# EAGLE design Robot Car (EAGLE 9.6.2)
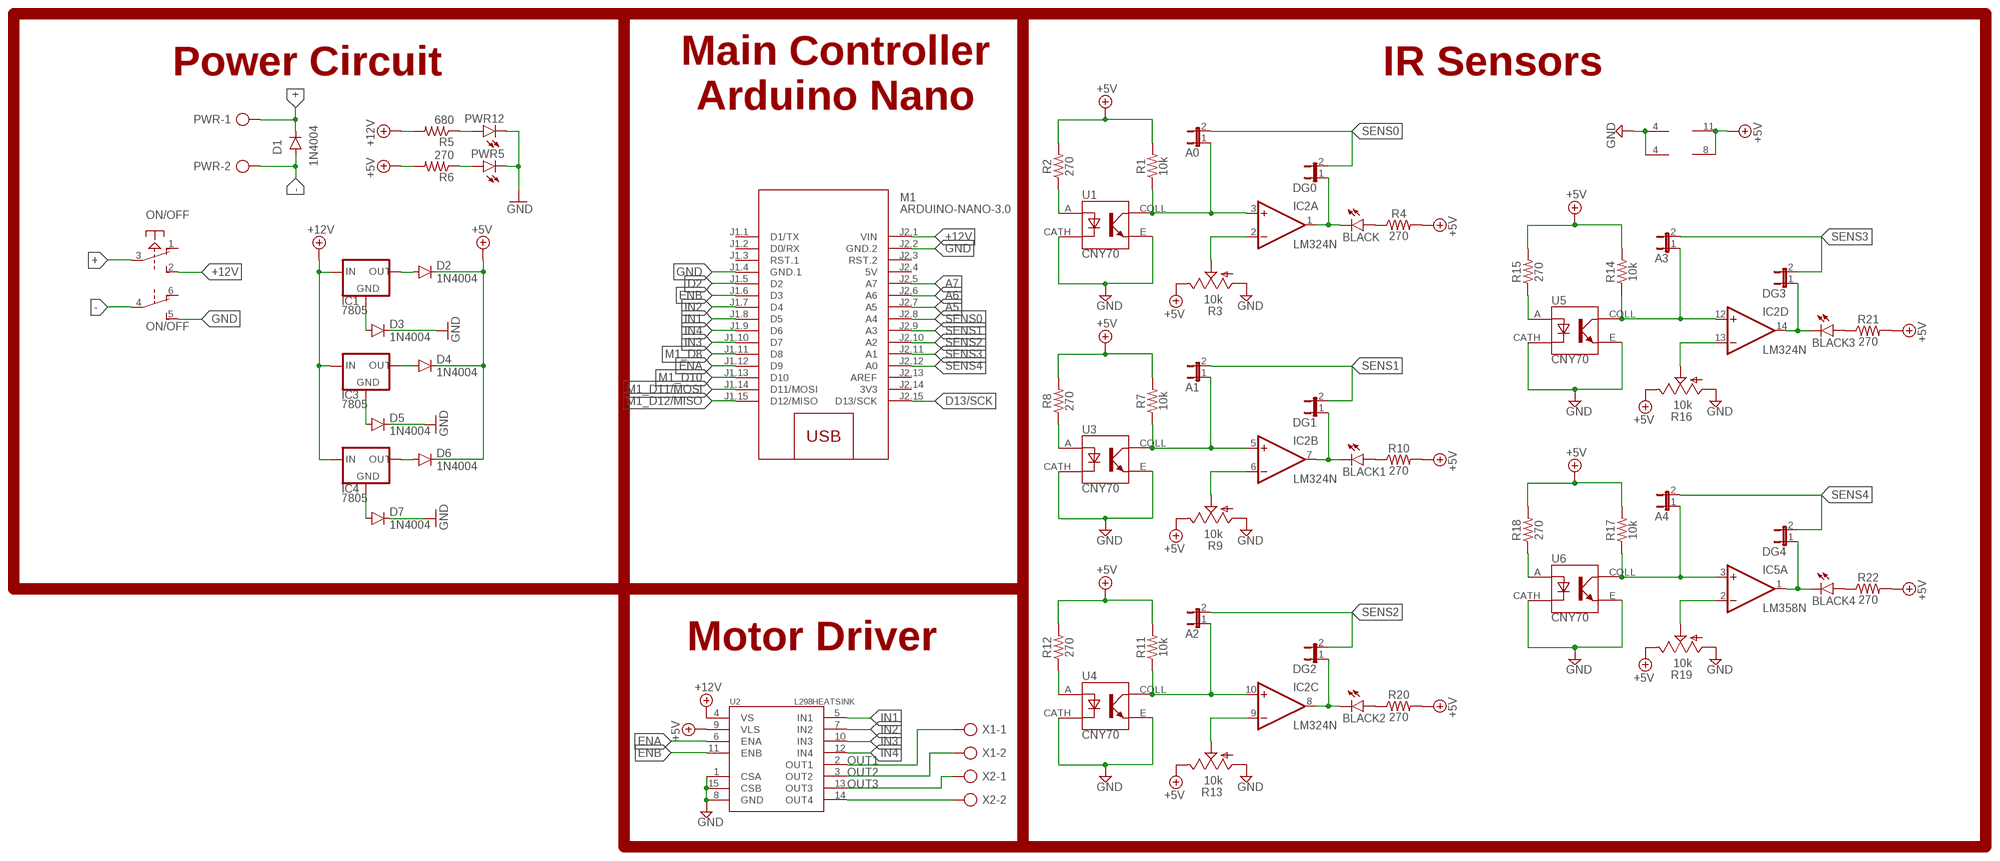
[diagram p0: schematic, sheet 1]

## Parts
A0  JP1E  [JP1]
A1  JP1E  [JP1]
A2  JP1E  [JP1]
A3  JP1E  [JP1]
A4  JP1E  [JP1]
BLACK  LED3MM  [LED3MM]
BLACK1  LED3MM  [LED3MM]
BLACK2  LED3MM  [LED3MM]
BLACK3  LED3MM  [LED3MM]
BLACK4  LED3MM  [LED3MM]
D1  1N4004  [DO41-10]
D2  1N4004  [DO41-10]
D3  1N4004  [DO41-10]
D4  1N4004  [DO41-10]
D5  1N4004  [DO41-10]
D6  1N4004  [DO41-10]
D7  1N4004  [DO41-10]
DG0  JP1E  [JP1]
DG1  JP1E  [JP1]
DG2  JP1E  [JP1]
DG3  JP1E  [JP1]
DG4  JP1E  [JP1]
IC1  7805  78XXS  [78XXS]
IC2  LM324N  [DIL14]
IC3  7805  78XXS  [78XXS]
IC4  7805  78XXS  [78XXS]
IC5  LM358N  [DIL08]
M1  ARDUINO-NANO-3.0  [ARDUINO-NANO-3.0]
ON/OFF  PVA2R  [PVA2R]
PWR  AK500/2-H  [AK500/2-H]
PWR5  LED3MM  [LED3MM]
PWR12  LED3MM  [LED3MM]
R1  10k  RESISTORAXIAL-0.3  [AXIAL-0.3]
R2  270  RESISTORAXIAL-0.3  [AXIAL-0.3]
R3  10k  TRIM_US-CA6V  [CA6V]
R4  270  RESISTORAXIAL-0.3  [AXIAL-0.3]
R5  680  RESISTORAXIAL-0.3  [AXIAL-0.3]
R6  270  RESISTORAXIAL-0.3  [AXIAL-0.3]
R7  10k  RESISTORAXIAL-0.3  [AXIAL-0.3]
R8  270  RESISTORAXIAL-0.3  [AXIAL-0.3]
R9  10k  TRIM_US-CA6V  [CA6V]
R10  270  RESISTORAXIAL-0.3  [AXIAL-0.3]
R11  10k  RESISTORAXIAL-0.3  [AXIAL-0.3]
R12  270  RESISTORAXIAL-0.3  [AXIAL-0.3]
R13  10k  TRIM_US-CA6V  [CA6V]
R14  10k  RESISTORAXIAL-0.3  [AXIAL-0.3]
R15  270  RESISTORAXIAL-0.3  [AXIAL-0.3]
R16  10k  TRIM_US-CA6V  [CA6V]
R17  10k  RESISTORAXIAL-0.3  [AXIAL-0.3]
R18  270  RESISTORAXIAL-0.3  [AXIAL-0.3]
R19  10k  TRIM_US-CA6V  [CA6V]
R20  270  RESISTORAXIAL-0.3  [AXIAL-0.3]
R21  270  RESISTORAXIAL-0.3  [AXIAL-0.3]
R22  270  RESISTORAXIAL-0.3  [AXIAL-0.3]
U1  CNY70  [DIPS254W50P254L710H600Q4]
U2  L298HEATSINK  [MULTIWATT15_6400BGHEATSINK]
U3  CNY70  [DIPS254W50P254L710H600Q4]
U4  CNY70  [DIPS254W50P254L710H600Q4]
U5  CNY70  [DIPS254W50P254L710H600Q4]
U6  CNY70  [DIPS254W50P254L710H600Q4]
X1  AK500/2-H  [AK500/2-H]
X2  AK500/2-H  [AK500/2-H]

## Nets
+: D1.C ON/OFF.3(1:P) PWR.1
+5V: D2.C D4.C D6.C IC2.11(P:V-) IC5.8(P:V+) R1.P$2 R2.P$2 R3.E R4.P$2 R6.P$2 R7.P$2 R8.P$2 R9.E R10.P$2 R11.P$2 R12.P$2 R13.E R14.P$2 R15.P$2 R16.E R17.P$2 R18.P$2 R19.E R20.P$2 R21.P$2 R22.P$2 U2.9(VLS)
+12V: IC1.IN IC3.IN IC4.IN M1.J2.1(VIN) ON/OFF.2(1:S) R5.P$2 U2.4(VS)
-: D1.A ON/OFF.4(2:P) PWR.2
A5: M1.J2.7(A5)
A6: M1.J2.6(A6)
A7: M1.J2.5(A7)
D2: M1.J1.5(D2)
D13/SCK: M1.J2.15(D13/SCK)
ENA: M1.J1.12(D9) U2.6(ENA)
ENB: M1.J1.6(D3) U2.11(ENB)
GND: D3.C D5.C D7.C IC2.4(P:V+) IC5.4(P:V-) M1.J1.4(GND.1) M1.J2.2(GND.2) ON/OFF.5(2:S) PWR5.K(C) PWR12.K(C) R3.A R9.A R13.A R16.A R19.A U1.CATH U1.E U2.1(CSA) U2.8(GND) U2.15(CSB) U3.CATH U3.E U4.CATH U4.E U5.CATH U5.E U6.CATH U6.E
IN1: M1.J1.8(D5) U2.5(IN1)
IN2: M1.J1.7(D4) U2.7(IN2)
IN3: M1.J1.10(D7) U2.10(IN3)
IN4: M1.J1.9(D6) U2.12(IN4)
M1_D8: M1.J1.11(D8)
M1_D10: M1.J1.13(D10)
M1_D11/MOSI: M1.J1.14(D11/MOSI)
M1_D12/MISO: M1.J1.15(D12/MISO)
N$1: R2.P$1 U1.A
N$2: PWR12.A R5.P$1
N$3: IC2.2(A:-IN) R3.S
N$4: PWR5.A R6.P$1
N$5: BLACK.A R4.P$1
N$6: D7.A IC4.GND
N$7: D5.A IC3.GND
N$8: D3.A IC1.GND
N$9: D2.A IC1.OUT
N$10: D6.A IC4.OUT
N$11: D4.A IC3.OUT
N$12: R8.P$1 U3.A
N$13: IC2.6(B:-IN) R9.S
N$14: BLACK1.A R10.P$1
N$15: R12.P$1 U4.A
N$16: IC2.9(C:-IN) R13.S
N$17: R15.P$1 U5.A
N$18: IC2.13(D:-IN) R16.S
N$19: R18.P$1 U6.A
N$20: IC5.2(A:-IN) R19.S
N$21: BLACK2.A R20.P$1
N$22: BLACK3.A R21.P$1
N$23: BLACK4.A R22.P$1
N$24: A4.1 IC5.3(A:+IN) R17.P$1 U6.COLL
N$25: BLACK4.K(C) DG4.1 IC5.1(A:OUT)
N$26: BLACK3.K(C) DG3.1 IC2.14(D:OUT)
N$27: A3.1 IC2.12(D:+IN) R14.P$1 U5.COLL
N$28: BLACK.K(C) DG0.1 IC2.1(A:OUT)
N$29: A0.1 IC2.3(A:+IN) R1.P$1 U1.COLL
N$30: A1.1 IC2.5(B:+IN) R7.P$1 U3.COLL
N$31: BLACK1.K(C) DG1.1 IC2.7(B:OUT)
N$32: A2.1 IC2.10(C:+IN) R11.P$1 U4.COLL
N$33: BLACK2.K(C) DG2.1 IC2.8(C:OUT)
N$42: U2.14(OUT4) X2.2
OUT1: U2.2(OUT1) X1.1
OUT2: U2.3(OUT2) X1.2
OUT3: U2.13(OUT3) X2.1
SENS0: A0.2 DG0.2 M1.J2.8(A4)
SENS1: A1.2 DG1.2 M1.J2.9(A3)
SENS2: A2.2 DG2.2 M1.J2.10(A2)
SENS3: A3.2 DG3.2 M1.J2.11(A1)
SENS4: A4.2 DG4.2 M1.J2.12(A0)
Unconnected: IC5.5(B:+IN) IC5.6(B:-IN) IC5.7(B:OUT) M1.J1.1(D1/TX) M1.J1.2(D0/RX) M1.J1.3(RST.1) M1.J2.3(RST.2) M1.J2.13(AREF) ON/OFF.1(1:O) ON/OFF.6(2:O)

## Notes on the sheet
- Power Circuit | IR Sensors
- Main Controller
  Arduino Nano
- Motor Driver

## Power pins joined to a net without a drawn wire
3V3: M1.J2.14(3V3)
5V: M1.J2.4(5V)

## Library data of the parts
A0 A1-A4 DG0 DG1-DG4 = jumper:JP1E: JUMPER
BLACK BLACK1-BLACK4 PWR5 PWR12 = led:LED: LED OSRAM: - CHIPLED LG R971, LG N971, LY N971, LG Q971, LY Q971, LO R971, LY R971 LH N974, LH R974 LS Q976, LO Q976, LY Q976 LO Q996 - Hyper CHIPLED LW Q18S LB Q993, LB Q99A, LB R99A - SideLED LS A670, LO A670, LY A670, LG A670, LP A670 LB A673, LV A673, LT A673, LW A673 LH A674 LY A675 LS A676, LA A676, LO A676, LY A676, LW A676 LS A679, LY A679, LG A679 - Hyper Micro SIDELED® LS Y876, LA Y876, LO Y876, LY Y876 LT Y87S - SmartLED LW L88C, LW L88S LB L89C, LB L89S, LG L890 LS L89K, LO L89K, LY L89K LS L896, LA L896, LO L896, LY L896 - TOPLED LS T670, LO T670, LY T670, LG T670, LP T670 LSG T670, LSP T670, LSY T670, LOP T670, LYG T670 LG T671, LOG T671, LSG T671 LB T673, LV T673, LT T673, LW T673 LH T674 LS T676, LA T676, LO T676, LY T676, LB T676, LH T676, LSB T676, LW T676 LB T67C, LV T67C, LT T67C, LS T67K, LO T67K, LY T67K, LW E67C LS E67B, LA E67B, LO E67B, LY E67B, LB E67C, LV E67C, LT E67C LW T67C LS T679, LY T679, LG T679 LS T770, LO T770, LY T770, LG T770, LP T770 LB T773, LV T773, LT T773, LW T773 LH T774 LS E675, LA E675, LY E675, LS T675 LS T776, LA T776, LO T776, LY T776, LB T776 LHGB T686 LT T68C, LB T68C - Hyper Mini TOPLED® LB M676 - Mini TOPLED Santana® LG M470 LS M47K, LO M47K, LY M47K Source: http://www.osram.convergy.de LUXEON: - LUMILED® LXK2-PW12-R00, LXK2-PW12-S00, LXK2-PW14-U00, LXK2-PW14-V00 LXK2-PM12-R00, LXK2-PM12-S00, LXK2-PM14-U00 LXK2-PE12-Q00, LXK2-PE12-R00, LXK2-PE12-S00, LXK2-PE14-T00, LXK2-PE14-U00 LXK2-PB12-K00, LXK2-PB12-L00, LXK2-PB12-M00, LXK2-PB14-N00, LXK2-PB14-P00, LXK2-PB14-Q00 LXK2-PR12-L00, LXK2-PR12-M00, LXK2-PR14-Q00, LXK2-PR14-R00 LXK2-PD12-Q00, LXK2-PD12-R00, LXK2-PD12-S00 LXK2-PH12-R00, LXK2-PH12-S00 LXK2-PL12-P00, LXK2-PL12-Q00, LXK2-PL12-R00 Source: www.luxeon.com KINGBRIGHT: KA-3528ASYC Source: www.kingbright.com
D1-D7 = diode:1N4004: DIODE general purpose rectifier, 1 A
IC1 IC3 IC4 = v-reg:78XXS: VOLTAGE REGULATOR
IC2 = linear:LM324: OP AMP
IC5 = linear:LM358: OP AMP also LM158; LM258; LM2904 Source: http://cache.national.com/ds/LM/LM158.pdf
M1 = Modules:ARDUINO-NANO-3.0: Arduino Nano 3.0 and compatible devices More details available here: https://www.arduino.cc/en/Main/ArduinoBoardNano Click here to find device on ebay.com <http://www.ebay.com/sch/arduino+nano>
ON/OFF = switch-misc:PVA2R: ITT SWITCH
PWR X1 X2 = con-ptr500:AK500/2-H: CONNECTOR Aug. 2004 / PTR Meßtechnik: Die Bezeichnung der Serie AK505 wurde geändert. Es handelt sich hierbei um AK500 in horizontaler Ausführung.; OC_FARNELL: unknown; OC_NEWARK: unknown
R1 R2 R4-R8 R10-R12 R14 R15 R17 R18 R20-R22 = SparkFun-Resistors:RESISTOR: Generic Resistor Package
R3 R9 R13 R16 R19 = pot:TRIM_US-: POTENTIOMETER
U1 U3-U6 = CNY70:CNY70: CNY70 Series 1 mA 1.25 V 950 nm 200 mW Reflective Optical Sensor 4 Pin Check prices <https://pricing.snapeda.com/parts/CNY70/Vishay/view-part?ref=eda>; AVAILABILITY: Good; DESCRIPTION: Reflective Optical Sensor 0.197 (5mm) PCB Mount; MF: Vishay; MP: CNY70; PACKAGE: PCB Mount Vishay; PRICE: None; PURCHASE-URL: https://pricing.snapeda.com/search/part/CNY70/?ref=eda
U2 = SparkFun-IC-Special-Function:L298: L298 Dual Full Bridge Driver

## Board
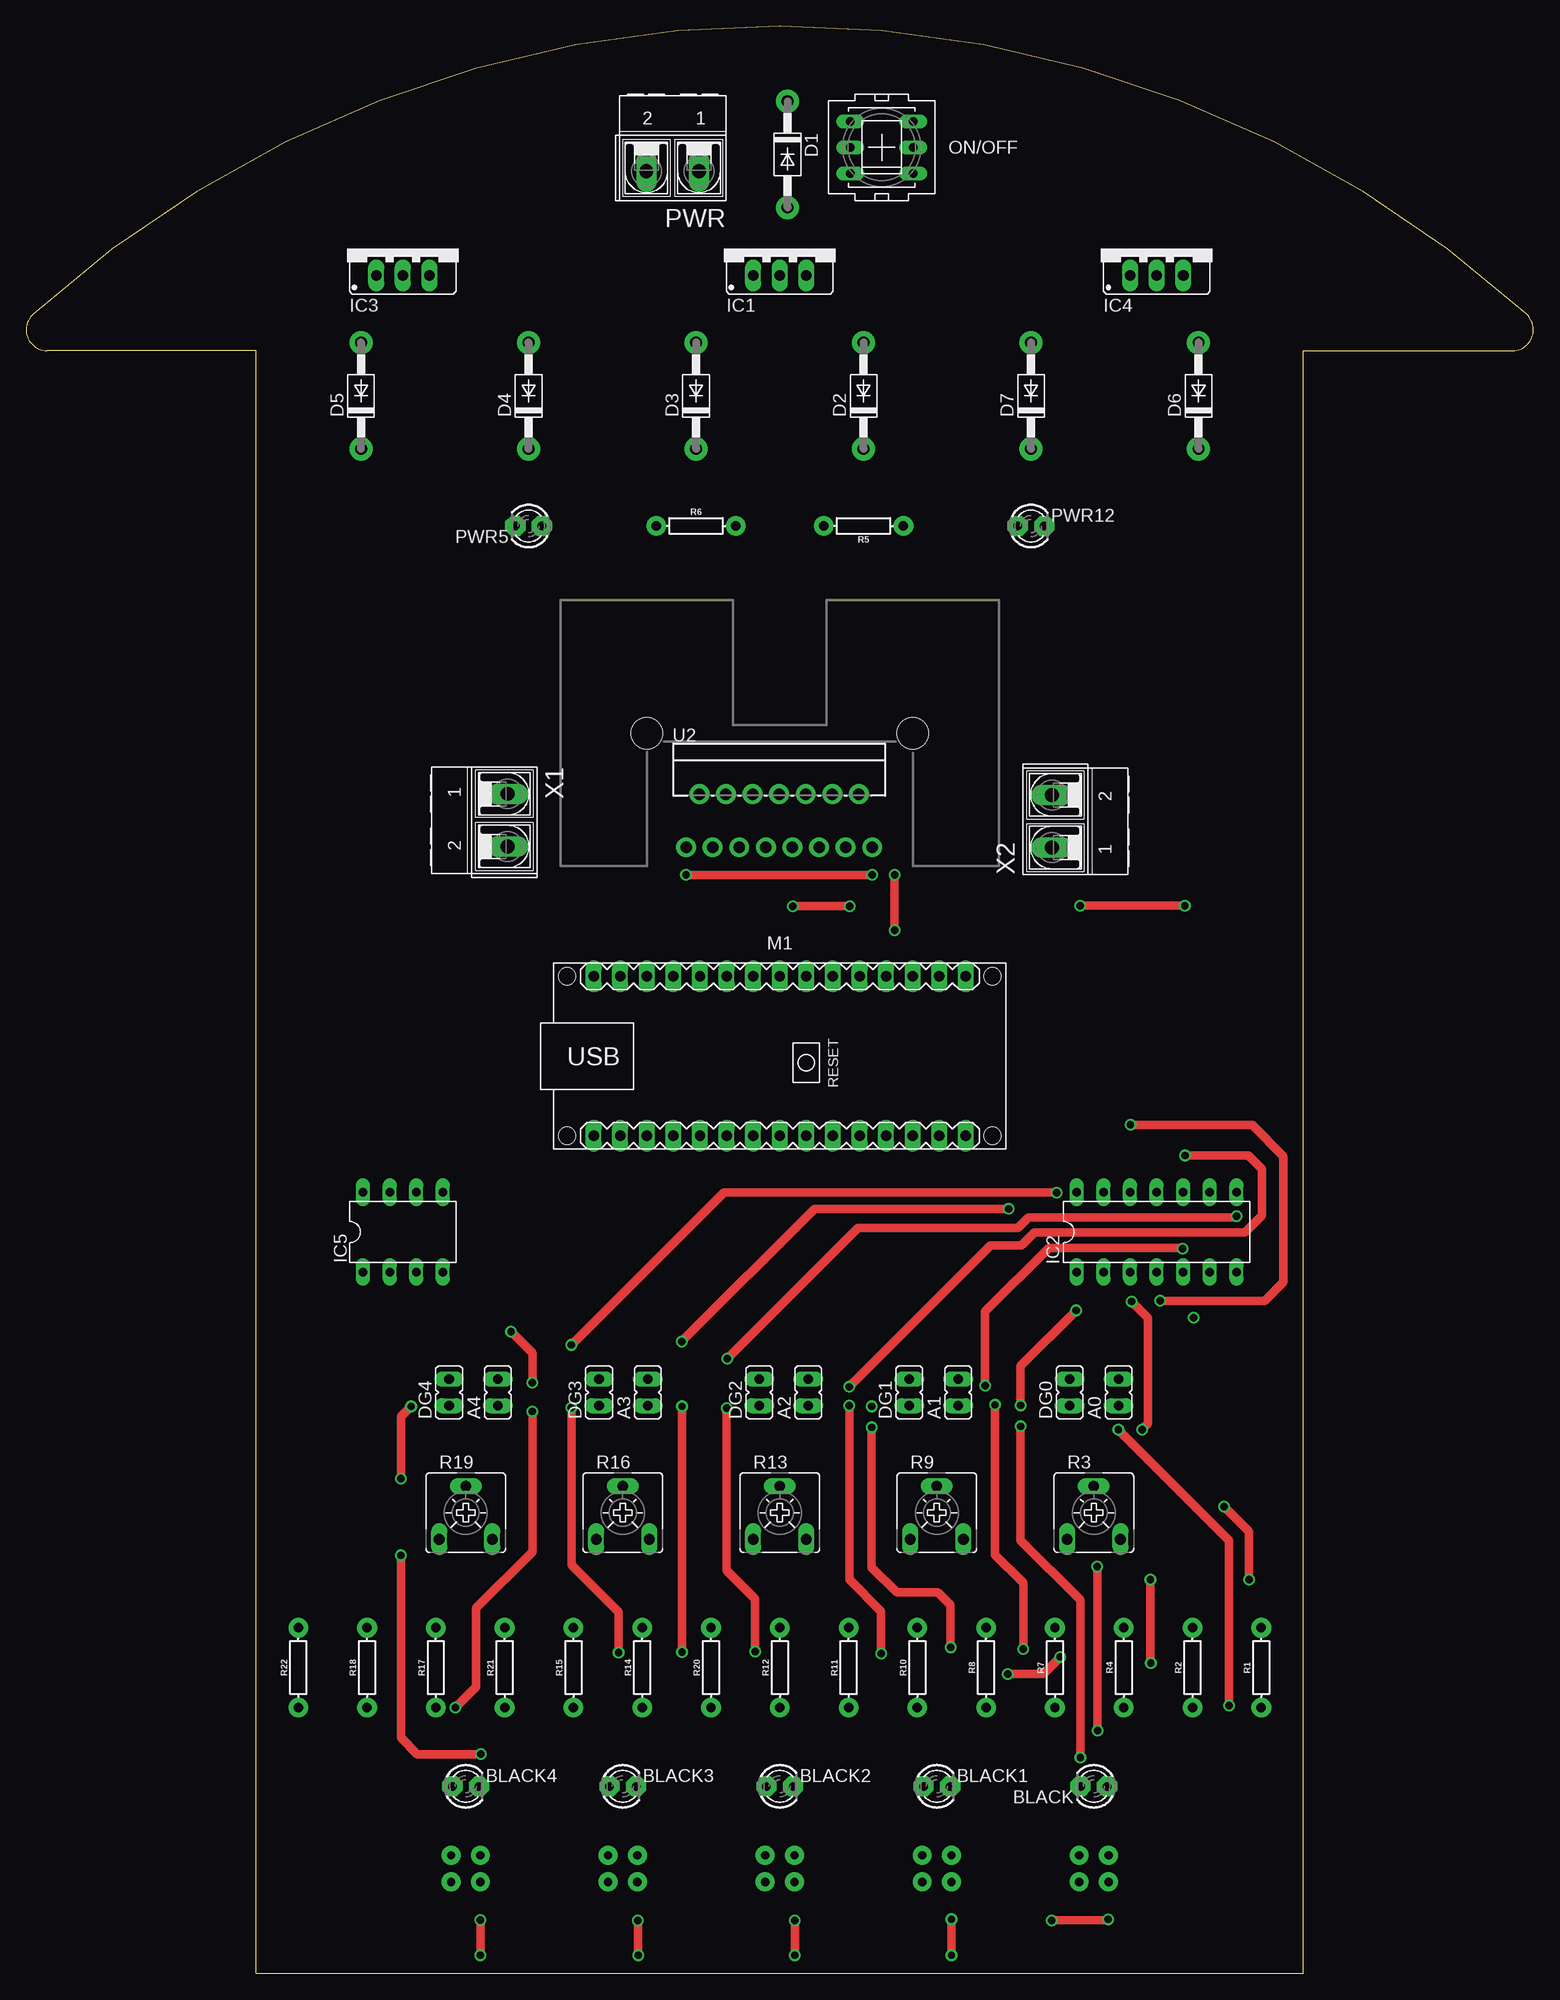
[diagram p1: board, top side]
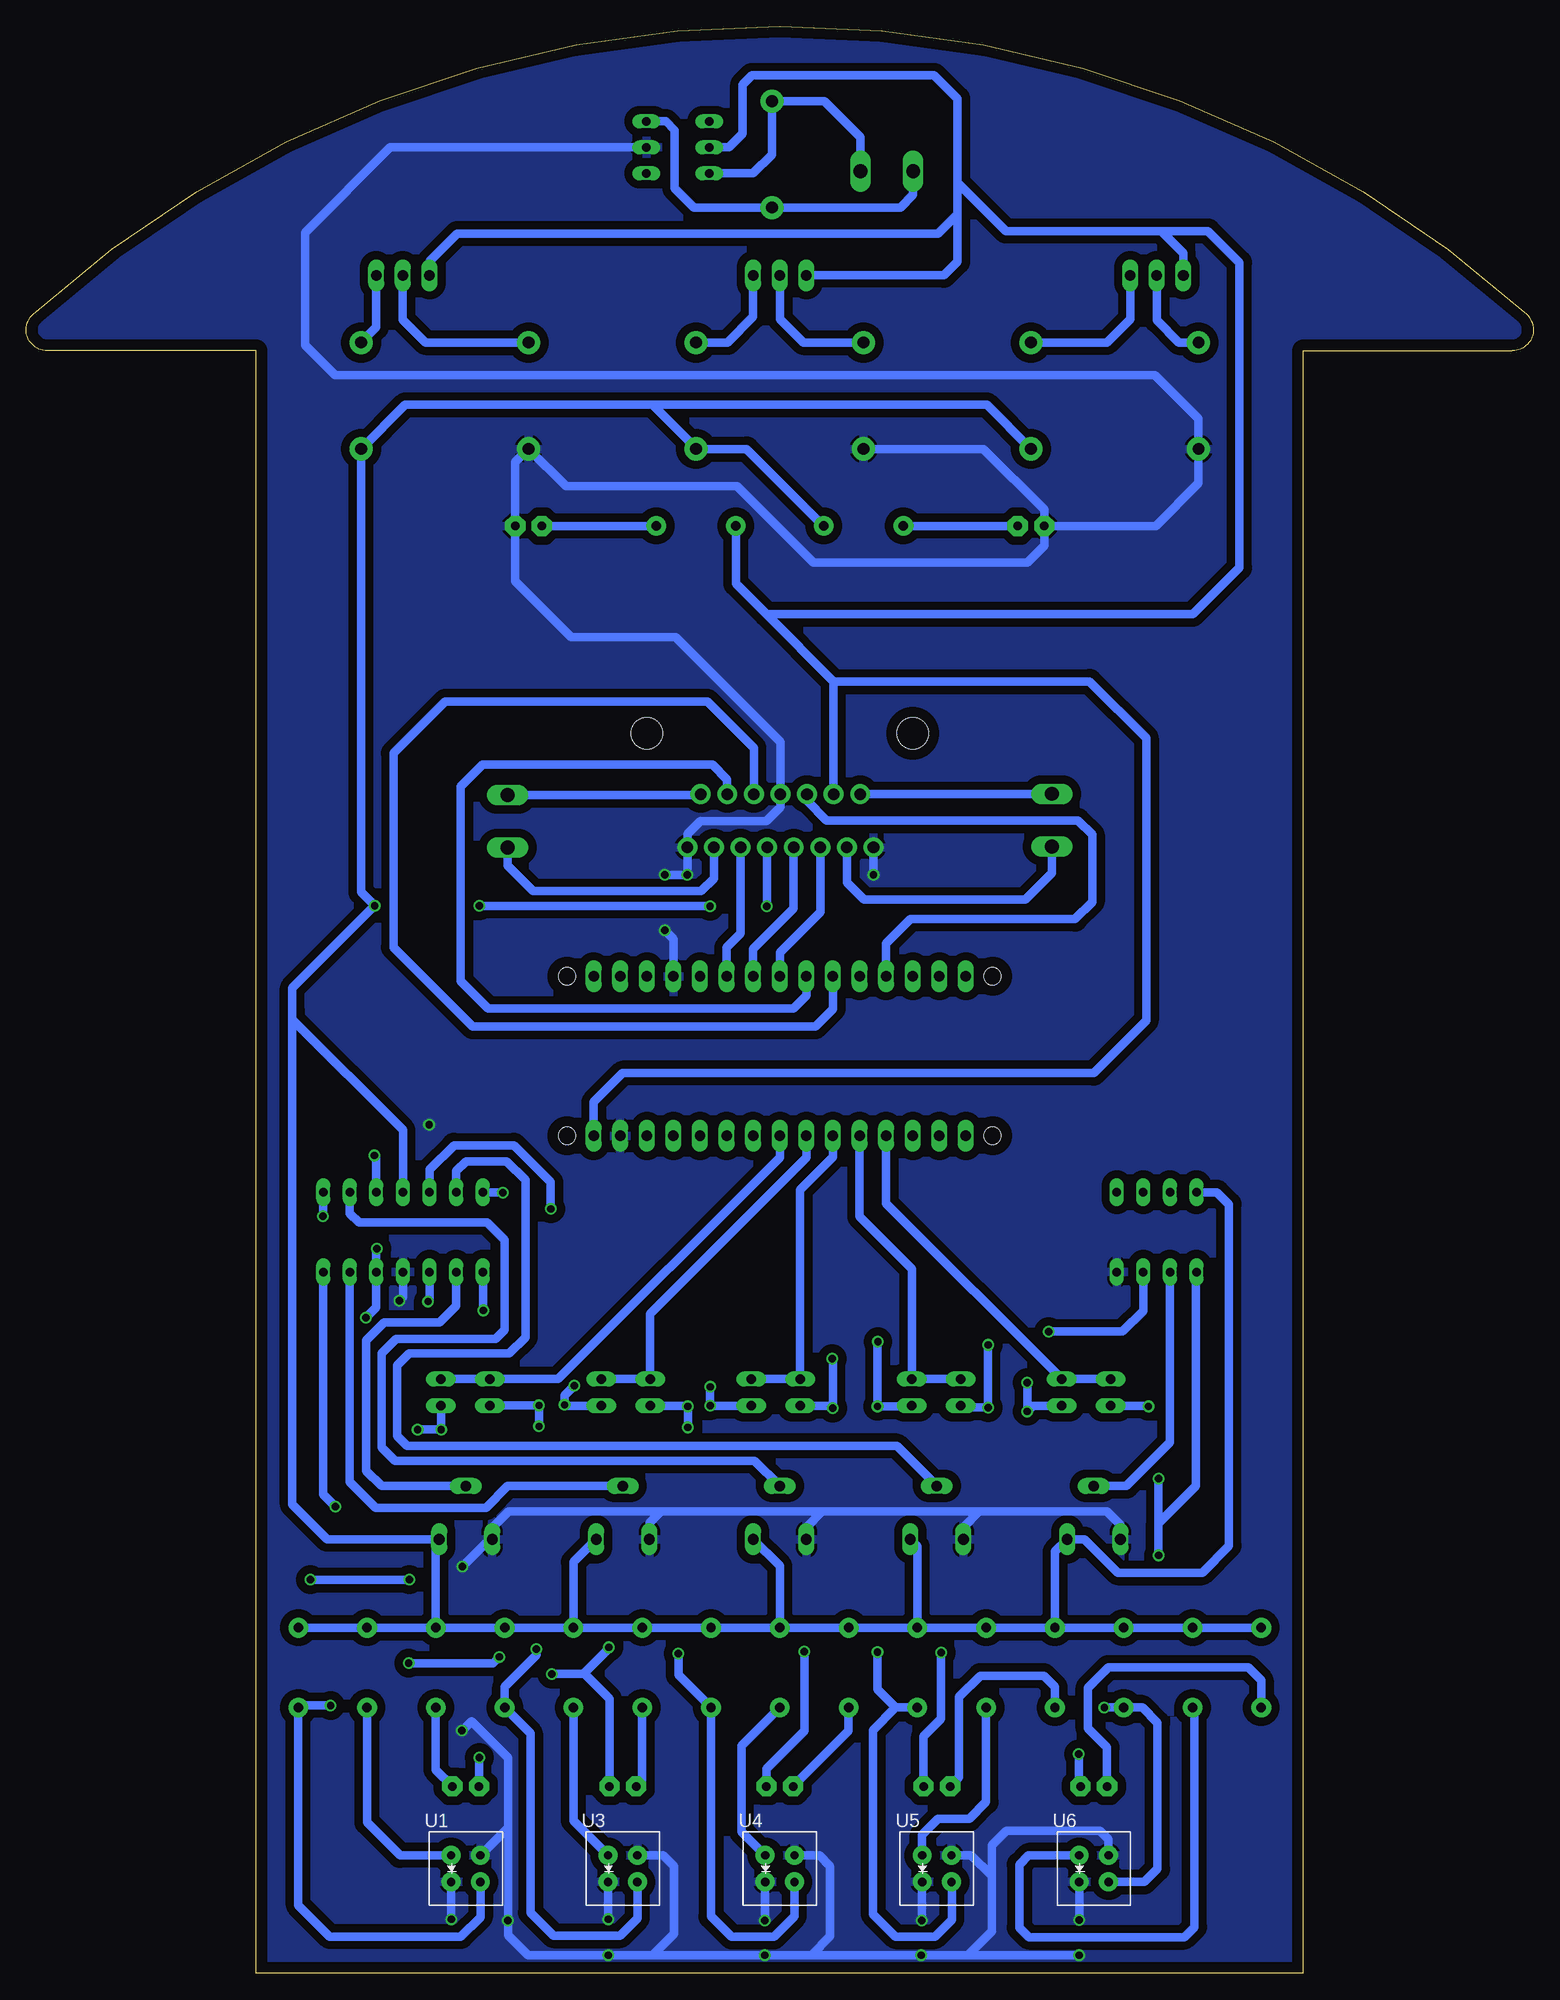
[diagram p2: board, bottom side, seen from below]

Size 143.99 x 186 mm. Coordinates in mm from the lower left corner, seen from the top.
Outline: 21.99,0 21.99,155 2,155 arc-138 0.66,158.48 arc-84 143.33,158.48 arc-138 141.99,155 121.99,155 121.99,0 21.99,0
Copper layers (1*16): Top 0.035mm / dielectric 1.5mm / Bottom 0.035mm
Design rules "default *": minimum track width 0.8mm, minimum drill 0.7mm, track to track 0.6mm, track to pad 0.6mm, pad to pad 0.6mm, via to via 0.6mm, smd to smd 0.6mm, copper to edge 40mil, drill to drill 6mil, minimum pad ring 10mil, minimum via ring 8mil, stop-mask expansion 4mil, vias tented up to drill 0mil, thermal gap 10mil

### Footprints (pad centres in the part's own frame; a part is rotated, then mirrored left to right if it is on the bottom)
JP1 = drill 0.914 long: 1 0,-1.27; 2 0,1.27
LED3MM = drill 0.813 pad 1.93 octagon: A -1.27,0; K 1.27,0
DO41-10 = drill 1.118 pad 2.2: A 5.08,0; C -5.08,0
78XXS = drill 1.016 long: GND 0,-2.54; IN -2.54,-2.54; OUT 2.54,-2.54
DIL14 = drill 0.813 long: 1 -7.62,-3.81; 2 -5.08,-3.81; 3 -2.54,-3.81; 4 0,-3.81; 5 2.54,-3.81; 6 5.08,-3.81; 7 7.62,-3.81; 8 7.62,3.81; 9 5.08,3.81; 10 2.54,3.81; 11 0,3.81; 12 -2.54,3.81; 13 -5.08,3.81; 14 -7.62,3.81
DIL08 = drill 0.813 long: 1 -3.81,-3.81; 2 -1.27,-3.81; 3 1.27,-3.81; 4 3.81,-3.81; 5 3.81,3.81; 6 1.27,3.81; 7 -1.27,3.81; 8 -3.81,3.81
ARDUINO-NANO-3.0 = drill 1 long: J1.1 17.78,7.62; J1.2 15.24,7.62; J1.3 12.7,7.62; J1.4 10.16,7.62; J1.5 7.62,7.62; J1.6 5.08,7.62; J1.7 2.54,7.62; J1.8 0,7.62; J1.9 -2.54,7.62; J1.10 -5.08,7.62; J1.11 -7.62,7.62; J1.12 -10.16,7.62; J1.13 -12.7,7.62; J1.14 -15.24,7.62; J1.15 -17.78,7.62; J2.1 17.78,-7.62; J2.2 15.24,-7.62; J2.3 12.7,-7.62; J2.4 10.16,-7.62; J2.5 7.62,-7.62; J2.6 5.08,-7.62; J2.7 2.54,-7.62; J2.8 0,-7.62; J2.9 -2.54,-7.62; J2.10 -5.08,-7.62; J2.11 -7.62,-7.62; J2.12 -10.16,-7.62; J2.13 -12.7,-7.62; J2.14 -15.24,-7.62; J2.15 -17.78,-7.62 | hole 1.651: -20.32,7.62; -20.32,-7.62; 20.32,-7.62; 20.32,7.62
PVA2R = drill 0.813 long: 1 -2.997,2.489; 2 -2.997,0; 3 -2.997,-2.489; 4 2.997,2.489; 5 2.997,0; 6 2.997,-2.489
AK500/2-H = drill 1.321 long: 1 -2.515,0; 2 2.515,0
AXIAL-0.3 = drill 0.9 pad 1.88: P$1 -3.81,0; P$2 3.81,0
CA6V = drill 1.016 long: A -2.54,-2.54; E 2.54,-2.54; S 0,2.54
DIPS254W50P254L710H600Q4 = drill 0.8 pad 1.8: A -1.4,1.27; CATH -1.4,-1.27; COLL 1.4,-1.27; E 1.4,1.27
MULTIWATT15_6400BGHEATSINK = drill 1.1 pad 1.9: 1 -8.95,-2.39; 2 -7.68,2.69; 3 -6.41,-2.39; 4 -5.14,2.69; 5 -3.87,-2.39; 6 -2.6,2.69; 7 -1.33,-2.39; 8 -0.06,2.69; 9 1.21,-2.39; 10 2.48,2.69; 11 3.75,-2.39; 12 5.02,2.69; 13 6.29,-2.39; 14 7.56,2.69; 15 8.83,-2.39 | hole 2.997: -12.7,8.509; 12.7,8.509

### Placement (x,y rotation side)
A0  104.35,55.49 0 top
A1  89.03,55.49 0 top
A2  74.71,55.49 0 top
A3  59.39,55.49 0 top
A4  45.06,55.49 0 top
BLACK  101.99,17.86 180 top
BLACK1  86.99,17.86 0 top
BLACK2  71.99,17.86 0 top
BLACK3  56.99,17.86 0 top
BLACK4  41.99,17.86 0 top
D1  72.73,173.75 270 top
D2  79.99,150.7 90 top
D3  63.99,150.7 90 top
D4  47.99,150.7 90 top
D5  31.99,150.7 90 top
D6  111.99,150.7 90 top
D7  95.99,150.7 90 top
DG0  99.69,55.49 0 top
DG1  84.37,55.49 0 top
DG2  70.05,55.49 0 top
DG3  54.73,55.49 0 top
DG4  40.4,55.49 0 top
IC1  71.99,164.74 0 top
IC2  107.99,70.81 0 top
IC3  35.98,164.74 0 top
IC4  108.01,164.74 0 top
IC5  35.99,70.81 0 top
M1  71.99,87.62 0 top
ON/OFF  81.73,174.42 0 top
PWR  61.76,172.14 180 top
PWR5  47.99,138.25 180 top
PWR12  95.99,138.25 0 top
R1  117.99,29.2 90 top
R2  111.42,29.2 90 top
R3  101.99,44 0 top
R4  104.85,29.2 90 top
R5  79.99,138.25 180 top
R6  63.99,138.25 0 top
R7  98.28,29.2 90 top
R8  91.71,29.2 90 top
R9  86.99,44 0 top
R10  85.14,29.2 90 top
R11  78.56,29.2 90 top
R12  71.99,29.2 90 top
R13  71.99,44 0 top
R14  58.85,29.2 90 top
R15  52.28,29.2 90 top
R16  56.99,44 0 top
R17  39.14,29.2 90 top
R18  32.56,29.2 90 top
R19  41.99,44 0 top
R20  65.42,29.2 90 top
R21  45.71,29.2 90 top
R22  25.99,29.2 90 top
U1  101.99,10 0 bottom
U2  71.99,109.95 0 top
U3  86.99,10 0 bottom
U4  71.99,10 0 bottom
U5  56.99,10 0 bottom
U6  41.99,10 0 bottom
X1  45.99,110.16 270 top
X2  97.99,110.05 90 top

### Tracks (layer width: path | path; a pad name or v marks a point on that pad's centre or on a via)
+
  Bottom 0.8: PWR.1 64.28,175.38 67.73,178.83 D1.C 72.73,173.75 74.54,171.93 ON/OFF.3
+5V  (via drill 0.7)
  Top 0.8: v73.23,101.93 v78.66,101.93 | v100.68,101.98 v110.69,101.98
  Bottom 0.8: 84.15,149.84 107.78,149.84 D6.C 111.99,103.28 v110.69,101.98 118.57,94.1 118.57,91.95 118.57,91.12 | 84.15,149.84 79.99,145.68 D2.C 75.17,145.62 R6.P$2 | 84.15,149.84 52.21,149.84 D4.C | U2.9 73.2,101.95 v73.23,101.93 | v78.66,101.93 100.63,101.93 v100.68,101.98 | R22.P$2 R18.P$2 R17.P$2 R21.P$2 | R21.P$2 45.71,40.29 R19.E 42.88,41.46 39.7,38.28 31.65,38.28 29.08,40.84 29.08,73.46 30.24,74.61 IC5.8 | R21.P$2 R15.P$2 R14.P$2 | R14.P$2 58.85,40.78 R16.E | R14.P$2 R20.P$2 R12.P$2 | R12.P$2 R11.P$2 R10.P$2 R8.P$2 | R12.P$2 71.99,38.92 R13.E | R9.E 91.71,39.29 R8.P$2 | R8.P$2 R7.P$2 R4.P$2 | R4.P$2 104.85,41.14 R3.E 115.25,41.46 118.57,44.77 118.57,91.12 | R4.P$2 R2.P$2 R1.P$2 | IC2.11 107.99,80.55 118.57,91.12
+12V
  Bottom 0.8: ON/OFF.2 76.86,174.42 75.54,175.74 75.54,180.42 74.65,181.31 57.25,181.31 55.01,179.07 55.01,171.04 | IC1.IN 56.31,162.2 55.01,163.5 55.01,168.05 | 55.01,171.04 55.01,168.05 | IC3.IN 33.44,164.31 35.56,166.42 | 35.56,166.42 50.39,166.42 55.01,171.04 | 55.01,168.05 56.87,166.19 102.82,166.19 105.47,163.54 IC4.IN | U2.4 66.85,123.41 | R5.P$2 76.18,132.74 73.26,129.82 | 66.85,123.41 73.26,129.82 | 35.56,166.42 31.09,166.42 28.09,163.42 28.09,134.26 32.53,129.82 73.26,129.82 | 66.85,123.41 42.4,123.41 36.99,118 36.99,91 41.99,86 86.99,86 89.77,83.22 M1.J2.1
-
  Bottom 0.8: PWR.2 59.25,169.88 60.46,168.67 D1.A 80.2,168.67 82.04,170.51 82.04,176.07 82.88,176.91 ON/OFF.4
ENA
  Bottom 0.8: U2.6 69.39,112.02 67.52,110.14 43.51,110.14 42.14,108.76 42.14,102.36 43.78,100.71 59.51,100.71 61.83,98.39 M1.J1.12
ENB
  Bottom 0.8: U2.11 75.74,99.31 77.07,97.98 M1.J1.6
GND  (via drill 0.7)
  Top 0.8: v80.82,104.93 80.79,104.9 63.27,104.9 v63.04,104.93 | v43.39,1.73 v43.39,5.08 | v58.44,5.06 58.44,1.75 v58.47,1.73 | v103.38,5.16 103.27,5.05 v97.96,5.05 | v88.39,5.16 v88.39,1.73 | v73.43,5.03 v73.43,1.73 | v102.31,38.86 102.36,38.8 v102.36,23.18 | v82.97,104.93 v82.97,99.62 | v108.34,64.25 118.32,64.25 120.12,66.05 120.12,78.05 117.14,81.03 105.52,81.03 v105.49,81.05
  Bottom 0.8: PWR5.K 46.72,139.82 52.53,145.62 D3.C | PWR5.K 36.08,138.25 31.99,142.34 D5.C 31.99,148.49 36.18,152.68 114.47,152.68 117.35,155.55 117.35,166.29 109.22,174.42 ON/OFF.5 | PWR5.K 46.72,136.38 48.36,134.75 68.77,134.75 76.07,142.05 92.42,142.05 D7.C 97.26,144.35 PWR12.K 97.26,132.98 91.92,127.64 81.96,127.64 71.93,117.61 U2.8 71.93,111.43 73.28,110.08 79.55,110.08 80.82,108.81 U2.15 v80.82,104.94 v80.82,104.93 v82.97,104.93 | U2.1 v63.04,104.94 v63.04,104.93 | R19.A 39.45,42.84 40.74,44.12 52.96,44.12 | 52.96,44.12 67.94,44.12 | 67.94,44.12 83.36,44.12 | 83.36,44.12 97.89,44.12 99.45,42.55 R3.A 99.7,41.46 v102.31,38.86 | 52.96,44.12 54.45,42.62 R16.A | 67.94,44.12 69.45,42.61 R13.A | 83.36,44.12 84.45,43.03 R9.A | 97.96,13.64 v97.96,5.05 97.96,3.66 96.03,1.73 v88.39,1.73 84.15,1.73 | 84.15,1.73 v73.43,1.73 68.98,1.73 | 68.98,1.73 v58.47,1.73 54.02,1.73 | 54.02,1.73 v43.39,1.73 | U6.E 40.59,12.78 41.42,13.61 50.37,13.61 51.74,12.24 51.74,9.3 | 51.74,9.3 51.74,4.01 54.02,1.73 | U5.E 53.71,11.27 51.74,9.3 | U6.CATH v43.39,5.08 | U5.CATH 58.39,5.11 v58.44,5.06 | U4.E 68.21,11.27 67.18,10.24 67.18,3.53 68.98,1.73 | U3.E 83.15,11.27 82.12,10.24 82.12,3.76 84.15,1.73 | U1.CATH 103.39,5.17 v103.38,5.16 | U3.CATH v88.39,5.16 | U4.CATH 73.39,5.07 v73.43,5.03 | v102.36,23.18 101.45,24.09 97.96,20.6 97.96,13.9 | 97.99,13.67 97.96,13.64 | 97.96,13.64 97.96,13.9 | U1.E 97.96,13.9 | v82.97,99.62 82.15,98.81 M1.J1.4 | IC2.4 107.99,64.6 v108.34,64.25
  pour Bottom (isolate 0.8): -18.01,197 -18.01,-5 148.99,-5 148.99,197
IN1
  Bottom 0.8: U2.5 68.12,101.37 71.99,97.5 M1.J1.8
IN2
  Bottom 0.8: U2.7 70.66,101.72 74.53,97.85 M1.J1.7
IN3
  Bottom 0.8: U2.10 74.47,117.05 78.91,121.49 103.96,121.49 108.89,116.56 108.89,97.99 101.32,90.42 68.6,90.42 66.9,92.13 66.9,95.23 M1.J1.10
IN4
  Bottom 0.8: U2.12 77.01,114.05 78.43,115.47 100.4,115.47 102.49,113.39 102.49,94.79 99.87,92.18 70.66,92.18 69.45,93.38 M1.J1.9
N$1
  Bottom 0.8: U1.A 108.27,11.27 111.42,14.42 R2.P$1
N$2
  Bottom 0.8: R5.P$1 PWR12.A | PWR12.A
N$3
  Bottom 0.8: R3.S 110.05,46.54 111.51,48 111.51,60.45 109.78,62.18 104.49,62.18 102.91,63.76 IC2.2
N$4
  Bottom 0.8: PWR5.A R6.P$1 | R6.P$1
N$5
  Bottom 0.8: R4.P$1 104.85,19.45 BLACK.A
N$6
  Bottom 0.8: IC4.GND 108.01,157.94 105.84,155.78 D7.A
N$7
  Bottom 0.8: IC3.GND 35.98,157.9 33.86,155.78 D5.A
N$8
  Bottom 0.8: IC1.GND 71.99,158.03 69.75,155.78 D3.A
N$9
  Bottom 0.8: IC1.OUT 74.53,158.23 76.98,155.78 D2.A
N$10
  Bottom 0.8: IC4.OUT 110.55,157.23 D6.A
N$11
  Bottom 0.8: IC3.OUT 38.52,158.02 40.76,155.78 D4.A
N$12
  Bottom 0.8: U3.A 91.71,14.58 R8.P$1
N$13
  Bottom 0.8: R9.S 97.98,46.54 100.04,44.47 110.59,44.47 113.07,46.96 IC2.6
N$14
  Bottom 0.8: R10.P$1 85.14,18.45 BLACK1.A
N$15
  Bottom 0.8: U4.A 75.64,13.52 75.64,21.74 R12.P$1
N$16
  Bottom 0.8: R13.S 74.4,48.95 108.73,48.95 110.01,50.23 110.01,59.22 108.63,60.6 99.16,60.6 98.29,61.47 98.29,70.04 99.98,71.72 112.2,71.72 113.07,72.6 IC2.9
N$17
  Bottom 0.8: U5.A 58.39,13.23 56.87,14.76 53.9,14.76 52.28,16.37 R15.P$1
N$18
  Bottom 0.8: R16.S 60.82,50.37 107.59,50.37 108.54,51.32 108.54,58.09 107.42,59.2 97.84,59.2 96.29,60.75 96.29,75.78 98.09,77.58 101.98,77.58 102.91,76.64 IC2.13
N$19
  Bottom 0.8: U6.A 48.24,11.27 49.12,10.39 49.12,4.37 48.21,3.45 33.35,3.45 32.38,4.42 32.38,25.2 R18.P$1
N$20
  Bottom 0.8: R19.S 38.88,46.54 34.72,50.69 IC5.2
N$21
  Bottom 0.8: R20.P$1 65.42,23.16 BLACK2.A
N$22
  Bottom 0.8: R21.P$1 45.71,27.35 46.78,28.42 52.83,28.42 54.86,26.39 54.86,18.73 BLACK3.A
N$23
  Bottom 0.8: BLACK4.A 40.72,21.57 42.54,23.39 42.54,27.28 40.61,29.21 27.23,29.21 25.99,27.98 R22.P$1
N$24  (via drill 0.7)
  Top 0.8: v40.99,25.38 43,27.39 43,34.9 48.36,40.26 v48.36,53.67 | v48.37,56.42 48.37,59.25 v46.32,61.3
  Bottom 0.8: U6.COLL 37.16,8.73 35.91,9.98 35.91,23.93 37.37,25.39 R17.P$1 40.98,25.39 v40.99,25.38 | A4.1 47.81,54.22 v48.36,53.67 48.36,56.41 v48.37,56.42 | v46.32,61.3 39.24,61.3 37.26,63.28 IC5.3
N$25  (via drill 0.7)
  Top 0.8: v43.43,20.93 37.36,20.93 35.81,22.48 v35.81,39.93 | v36.78,54.15 35.81,53.19 v35.81,47.24
  Bottom 0.8: BLACK4.K 43.43,18.03 v43.43,20.93 | v36.78,54.15 36.84,54.22 DG4.1 | v35.81,47.24 v35.81,39.93 35.81,43 32.26,46.56 32.26,66.92 IC5.1
N$26  (via drill 0.7)
  Top 0.8: v56.59,30.63 56.59,34.54 52.09,39.04 v52.09,54.05 | v52.09,60.02 66.64,74.58 v98.44,74.58
  Bottom 0.8: BLACK3.K 58.26,22.66 56.59,24.33 v56.59,30.63 | DG3.1 54.56,54.05 v52.09,54.05 v52.09,60.02 | v98.44,74.58 98.48,74.61 IC2.14
N$27  (via drill 0.7)
  Top 0.8: v62.66,30.68 v62.66,54.15 | v93.87,73.02 75.29,73.02 v62.62,60.35
  Bottom 0.8: R14.P$1 60.92,25.39 | U5.COLL 55.55,8.68 55.55,5.13 57.17,3.5 60.93,3.5 63.09,5.66 63.09,23.22 60.92,25.39 | 60.92,25.39 62.66,27.13 v62.66,30.68 | A3.1 59.45,54.15 v62.66,54.15 62.66,60.31 v62.62,60.35 | IC2.12 105.45,76.77 103.12,79.1 97.39,79.1 93.87,75.58 v93.87,73.02
N$28  (via drill 0.7)
  Top 0.8: v94.99,52.25 94.99,41.38 100.71,35.66 v100.71,20.62 | v94.99,54.25 94.99,58 v100.32,63.33
  Bottom 0.8: BLACK.K 100.72,20.61 v100.71,20.62 | DG0.1 99.66,54.25 v94.99,54.25 v94.99,52.25 | v100.32,63.33 100.32,66.94 IC2.1
N$29  (via drill 0.7)
  Top 0.8: v104.34,51.92 114.91,41.35 v114.91,25.58 | v106.59,51.95 107.17,52.52 107.17,62.6 v105.59,64.17
  Bottom 0.8: U1.COLL 100.59,5.37 102.47,3.5 114.98,3.5 117.99,6.52 R1.P$1 117.8,25.58 v114.91,25.58 | A0.1 104.35,51.94 v104.34,51.92 104.37,51.95 v106.59,51.95 | v105.59,64.17 105.44,64.33 105.44,66.98 IC2.3
N$30  (via drill 0.7)
  Top 0.8: v95.25,30.96 95.25,37.29 92.54,40 92.54,54.29 v92.55,54.3 | v91.61,56.15 91.61,63.21 97.71,69.32 110.37,69.32 v110.47,69.22
  Bottom 0.8: U3.COLL 85.59,5.26 87.25,3.61 93.62,3.61 95.81,5.79 95.81,22.91 R7.P$1 98.28,27.37 95.25,30.4 v95.25,30.96 | A1.1 92.47,54.22 v92.55,54.3 92.55,55.2 v91.61,56.15 | v111.52,62.64 110.53,63.62 IC2.5 110.53,69.15 v110.47,69.22
N$31  (via drill 0.7)
  Top 0.8: v88.31,31.14 88.31,35.18 87.12,36.37 83.18,36.37 80.77,38.79 v80.77,52.15 | v114.44,44.58 116.82,42.2 v116.82,37.62 | v107.39,37.6 107.39,29.68 v107.44,29.62 | v98.79,30.23 97.17,28.6 v93.77,28.6
  Bottom 0.8: BLACK1.K 88.26,26.23 90.64,28.6 90.75,28.6 | v88.31,31.14 88.26,31.09 90.75,28.6 | DG1.1 80.84,54.22 v80.77,54.15 v80.77,52.15 | IC2.7 115.61,45.74 v114.44,44.58 | v116.82,37.62 116.79,37.6 v107.39,37.6 | v107.44,29.62 99.39,29.62 v98.79,30.23 | v93.77,28.6 90.75,28.6
N$32  (via drill 0.7)
  Top 0.8: v81.68,30.53 81.68,34.57 78.64,37.62 v78.64,54.23 | v78.62,56.02 92.12,69.53 95.09,69.53 96.34,70.77 116.42,70.77 118.04,72.4 118.04,76.83 116.74,78.12 v110.72,78.12
  Bottom 0.8: U4.COLL 70.59,5.45 72.56,3.48 76.6,3.48 78.56,5.44 R11.P$1 81.68,28.51 v81.68,30.53 | A2.1 v78.63,54.22 v78.64,54.23 78.64,56.01 v78.62,56.02 | v110.72,78.12 110.53,77.94 IC2.10
N$33  (via drill 0.7)
  Top 0.8: v69.64,30.73 69.64,35.76 66.93,38.48 v66.93,53.98 | v66.97,58.7 79.47,71.2 94.74,71.2 95.77,72.22 115.54,72.22 v115.64,72.33
  Bottom 0.8: BLACK2.K 73.26,19.55 69.64,23.16 v69.64,30.73 | DG2.1 67.17,54.22 v66.93,53.98 66.93,58.66 v66.97,58.7 | v115.64,72.33 115.61,72.36 IC2.8
N$42
  Bottom 0.8: X2.2 79.63,112.57 U2.14
OUT1
  Bottom 0.8: U2.2 45.99,112.64 X1.1
OUT2
  Bottom 0.8: U2.3 65.58,104.21 63.96,102.59 48.53,102.59 45.99,105.13 X1.2
OUT3
  Bottom 0.8: X2.1 97.99,105.81 95.56,103.38 79.5,103.38 78.28,104.59 U2.13
SENS0
  Bottom 0.8: A0.2 DG0.2 93.19,56.76 71.99,77.96 M1.J2.8
SENS1
  Bottom 0.8: A1.2 DG1.2 84.37,63 69.45,77.92 M1.J2.9
SENS2
  Bottom 0.8: A2.2 DG2.2 70.05,74.83 66.91,77.97 M1.J2.10
SENS3
  Bottom 0.8: DG3.2 A3.2 59.39,67.3 64.37,72.29 M1.J2.11
SENS4
  Bottom 0.8: DG4.2 A4.2 45.06,56.77 61.83,73.54 M1.J2.12